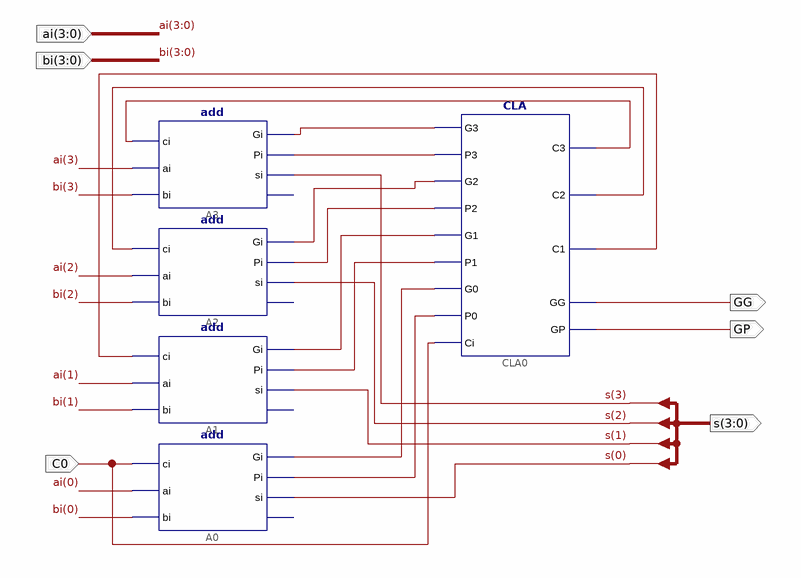
[diagram p0: schematic sheet 1]
// Xilinx ISE schematic ACLA4.sch (spartan3) as structural Verilog: 5 symbols, 6 ports
module ACLA4 (
  input  C0,
  input  [3:0] ai,
  input  [3:0] bi,
  output GP,
  output [3:0] s,
  output GG
);

  wire XLXN_7, XLXN_8, XLXN_9, XLXN_10, XLXN_11, XLXN_12, XLXN_13, XLXN_14, XLXN_180, XLXN_217, XLXN_218;

  add A2 (.ci(XLXN_13), .ai(ai[2]), .bi(bi[2]), .si(s[2]), .Gi(XLXN_10), .Pi(XLXN_9));  // open: co
  add A3 (.ci(XLXN_14), .ai(ai[3]), .bi(bi[3]), .si(s[3]), .Gi(XLXN_12), .Pi(XLXN_11));  // open: co
  CLA CLA0 (
    .G3(XLXN_12), .P3(XLXN_11), .G2(XLXN_10), .P0(XLXN_180), .Ci(C0), .G0(XLXN_218), .P2(XLXN_9),
    .G1(XLXN_7), .P1(XLXN_217), .C3(XLXN_14), .C2(XLXN_13), .C1(XLXN_8), .GP(GP), .GG(GG));
  add A1 (.ci(XLXN_8), .ai(ai[1]), .bi(bi[1]), .si(s[1]), .Gi(XLXN_7), .Pi(XLXN_217));  // open: co
  add A0 (.ci(C0), .ai(ai[0]), .bi(bi[0]), .si(s[0]), .Gi(XLXN_218), .Pi(XLXN_180));  // open: co
endmodule
